# EAGLE schematic maplepad_pro (EAGLE 9.6.1)
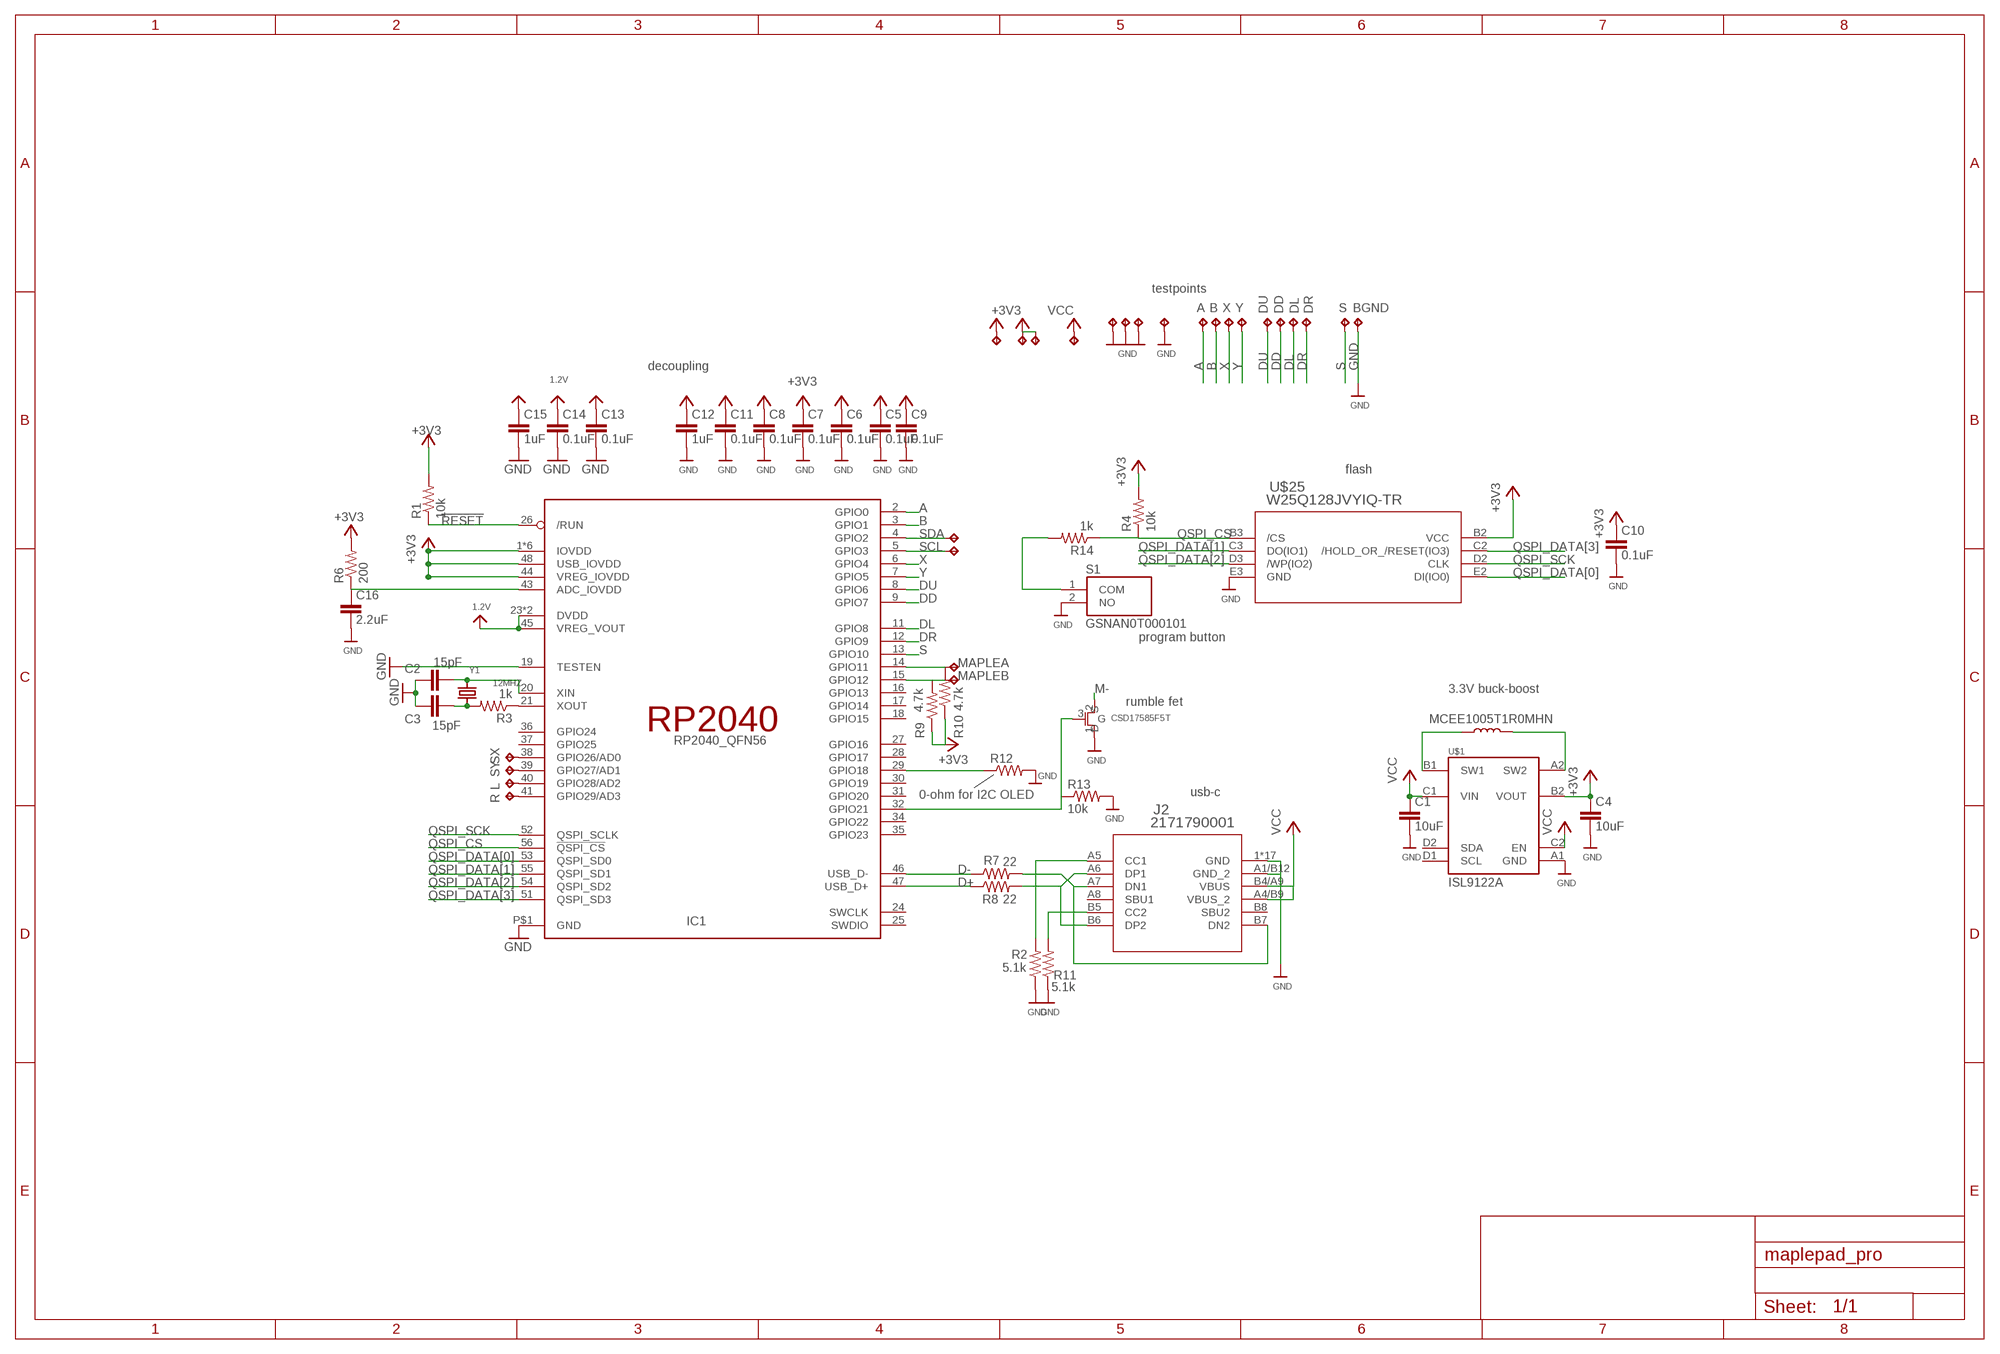
[diagram p0: schematic, sheet 1]

## Parts
A  TPTP10R  [TP10R]
A0  TPTP10R  [TP10R]
B  TPTP10R  [TP10R]
B0  TPTP10R  [TP10R]
BGND  TPTP10R  [TP10R]
C1  10uF  C-USC0402  [C0402]
C2  15pF  C-USC0201  [C0201]
C3  15pF  C-USC0201  [C0201]
C4  10uF  C-USC0402  [C0402]
C5  0.1uF  C-USC0201  [C0201]
C6  0.1uF  C-USC0201  [C0201]
C7  0.1uF  C-USC0201  [C0201]
C8  0.1uF  C-USC0201  [C0201]
C9  0.1uF  C-USC0201  [C0201]
C10  0.1uF  C-USC0201  [C0201]
C11  0.1uF  C-USC0201  [C0201]
C12  1uF  C-USC0402  [C0402]
C13  0.1uF  C-USC0201  [C0201]
C14  0.1uF  C-USC0201  [C0201]
C15  1uF  C-USC0402  [C0402]
C16  2.2uF  C-USC0402  [C0402]
DD  TPTP10R  [TP10R]
DL  TPTP10R  [TP10R]
DR  TPTP10R  [TP10R]
DU  TPTP10R  [TP10R]
IC1  RP2040_QFN56  [QFN56_7MM_REDUCEDEPAD]
J2  2171790001  [2171790001_MOL]
L  TPTP10R  [TP10R]
L2  MCEE1005T1R0MHN  L0402  [R0402]
LR3.1  TPTP10R  [TP10R]
LR3.3  TPTP10R  [TP10R]
LRGND  TPTP10R  [TP10R]
LRGND1  TPTP10R  [TP10R]
R  TPTP10R  [TP10R]
R1  10k  R-US_R0201  [R0201]
R2  5.1k  R-US_R0201  [R0201]
R3  1k  R-US_R0201  [R0201]
R4  10k  R-US_R0201  [R0201]
R6  200  R-US_R0201  [R0201]
R7  22  R-US_R0201  [R0201]
R8  22  R-US_R0201  [R0201]
R9  4.7k  R-US_R0201  [R0201]
R10  4.7k  R-US_R0201  [R0201]
R11  5.1k  R-US_R0201  [R0201]
R12  0-ohm for I2C OLED  R-US_R0201  [R0201]
R13  10k  R-US_R0201  [R0201]
R14  1k  R-US_R0201  [R0201]
S  TPTP10R  [TP10R]
S1  GSNAN0T000101  [GSNAN0T000101]
S3.3  TPTP10R  [TP10R]
SCL  TPTP10R  [TP10R]
SDA  TPTP10R  [TP10R]
SGND  TPTP10R  [TP10R]
SX  TPTP10R  [TP10R]
SY  TPTP10R  [TP10R]
U1  CSD17585F5T  [YJK3_TEX]
U$1  ISL9122A  [ISL9122A]
U$25  W25Q128JVYIQ-TR  [WLCSP24]
V3.3  TPTP10R  [TP10R]
VGND  TPTP10R  [TP10R]
X  TPTP10R  [TP10R]
Y  TPTP10R  [TP10R]
Y1  12MHZ  CRYSTAL2.5X2.0  [CRYSTAL_2.5X2]

## Nets
1.2V: C13.1 C14.1 C15.1 IC1.23(DVDD) IC1.45(VREG_VOUT) IC1.50(DVDD)
!RESET: IC1.26(/RUN) R1.1
+3V3: C4.1 C5.1 C6.1 C7.1 C8.1 C9.1 C10.1 C11.1 C12.1 IC1.1(IOVDD) IC1.10(IOVDD) IC1.22(IOVDD) IC1.33(IOVDD) IC1.42(IOVDD) IC1.44(VREG_IOVDD) IC1.48(USB_IOVDD) IC1.49(IOVDD) LR3.3.TP R1.2 R4.2 R6.2 R9.1 R10.1 S3.3.TP U$1.B2(VOUT) U$25.B2(VCC) V3.3.TP
A: A.TP IC1.2(GPIO0)
B: B.TP IC1.3(GPIO1)
D+: IC1.47(USB_D+) R8.1
D-: IC1.46(USB_D-) R7.1
DD: DD.TP IC1.9(GPIO7)
DL: DL.TP IC1.11(GPIO8)
DR: DR.TP IC1.12(GPIO9)
DU: DU.TP IC1.8(GPIO6)
GND [power]: BGND.TP C1.2 C2.1 C3.1 C4.2 C5.2 C6.2 C7.2 C8.2 C9.2 C10.2 C11.2 C12.2 C13.2 C14.2 C15.2 C16.2 IC1.19(TESTEN) IC1.P$1(GND) J2.1(GND) J2.2(GND) J2.3(GND) J2.4(GND) J2.13(GND) J2.14(GND) J2.15(GND) J2.16(GND) J2.A1/B12(GND_2) J2.B1/A12(GND) J2.S_1_H1(GND) J2.S_1_H2(GND) J2.S_2_H1(GND) J2.S_2_H2(GND) J2.S_3_H1(GND) J2.S_3_H2(GND) J2.S_4_H1(GND) J2.S_4_H2(GND) LRGND1.TP LRGND.TP R2.1 R11.1 R12.2 R13.2 S1.2(NO) SGND.TP U1.1(S) U$1.A1(GND) U$25.E3(GND) VGND.TP
M-: U1.2(D)
MAPLEA: A0.TP IC1.14(GPIO11) R10.2
MAPLEB: B0.TP IC1.15(GPIO12) R9.2
N$1: IC1.41(GPIO29/AD3) R.TP
N$2: IC1.40(GPIO28/AD2) L.TP
N$3: L2.1 U$1.B1(SW1)
N$4: L2.2 U$1.A2(SW2)
N$5: C2.2 IC1.20(XIN) Y1.3
N$6: C3.2 R3.2 Y1.1
N$7: IC1.21(XOUT) R3.1
N$8: R14.2 S1.1(COM)
N$9: C16.1 IC1.43(ADC_IOVDD) R6.1
N$10: J2.A7(DN1) J2.B7(DN2) R7.2
N$11: J2.A6(DP1) J2.B6(DP2) R8.2
N$12: IC1.39(GPIO27/AD1) SY.TP
N$13: IC1.38(GPIO26/AD0) SX.TP
N$16: IC1.29(GPIO18) R12.1
N$17: J2.B5(CC2) R11.2
N$18: J2.A5(CC1) R2.2
N$20: IC1.32(GPIO21) R13.1 U1.3(G)
QSPI_CS: IC1.56(!QSPI_CS) R4.1 R14.1 U$25.B3(/CS)
QSPI_DATA[0]: IC1.53(QSPI_SD0) U$25.E2(DI(IO0))
QSPI_DATA[1]: IC1.55(QSPI_SD1) U$25.C3(DO(IO1))
QSPI_DATA[2]: IC1.54(QSPI_SD2) U$25.D3(/WP(IO2))
QSPI_DATA[3]: IC1.51(QSPI_SD3) U$25.C2(/HOLD_OR_/RESET(IO3))
QSPI_SCK: IC1.52(QSPI_SCLK) U$25.D2(CLK)
S: IC1.13(GPIO10) S.TP
SCL: IC1.5(GPIO3) SCL.TP
SDA: IC1.4(GPIO2) SDA.TP
VCC: C1.1 J2.A4/B9(VBUS_2) J2.B4/A9(VBUS) LR3.1.TP U$1.C1(VIN) U$1.C2(EN)
X: IC1.6(GPIO4) X.TP
Y: IC1.7(GPIO5) Y.TP
Unconnected: IC1.16(GPIO13) IC1.17(GPIO14) IC1.18(GPIO15) IC1.24(SWCLK) IC1.25(SWDIO) IC1.27(GPIO16) IC1.28(GPIO17) IC1.30(GPIO19) IC1.31(GPIO20) IC1.34(GPIO22) IC1.35(GPIO23) IC1.36(GPIO24) IC1.37(GPIO25) J2.A8(SBU1) J2.B8(SBU2) U$1.D1(SCL) U$1.D2(SDA)

## Notes on the sheet
- testpoints
- decoupling
- flash
- program button
- 3.3V buck-boost
- rumble fet
- MCEE1005T1R0MHN
- usb-c
- ISL9122A

## Library data of the parts
A A0 B B0 BGND DD DL DR DU L LR3.1 LR3.3 LRGND LRGND1 R S S3.3 SCL SDA SGND SX SY V3.3 VGND X Y = testpad:TP: Test pad
C1-C16 = resistor:C-US: CAPACITOR, American symbol
IC1 = personal:RP2040
J2 = personal:2171790001; COPYRIGHT: Copyright (C) 2022 Ultra Librarian. All rights reserved.; MANUFACTURER_PART_NUMBER: 2171790001; MFR_NAME: Molex Connector Corporation
L2 = resistor:L0402
R1-R4 R6-R14 = resistor:R-US_: RESISTOR, American symbol
S1 = personal:GSNAN0T000101: Tactile Switches NANOT 100 AS Source: Datasheet <https://www.ckswitches.com/media/2866/nanot.pdf>; DESCRIPTION: Tactile Switches NANOT 100 AS; HEIGHT: 0.55mm; MANUFACTURER_NAME: C & K COMPONENTS; MANUFACTURER_PART_NUMBER: GSNAN0T000101; MOUSER_PART_NUMBER: 611-GSNAN0T000101; MOUSER_PRICE-STOCK: https://www.mouser.co.uk/ProductDetail/CK/GSNAN0T000101?qs=bAKSY%2FctAC7diJ%2FxJL3YRQ%3D%3D
U1 = personal:CSD17585F5T; COPYRIGHT: Copyright (C) 2018 Accelerated Designs. All rights reserved; MANUFACTURER_PART_NUMBER: CSD17585F5T; SOURCELIBRARY: TI_2019-05-21; VENDOR: Texas Instruments
U$1 = personal:ISL9122A
U$25 = personal:W25Q128JVYIQ-TR
Y1 = personal:CRYSTAL: Crystals HC49UP - Surface Mount Crystal 4.0MHz 18pF +/-30ppm Surface Mount Crystal [Digikey: 535-9857-1-ND] 12.0 MHz Surface Mount Crystal [Digikey: 535-9869-6-ND] 25.0 MHz Surface Mount Crystal [Digikey: 535-9078-1-ND] 2.5 x 2.0mm - MEMs SMT Crystal 16.0 MHz 10pF 20ppm 2.5 x 2.0mm Crystal [Digikey -40-85°C: 535-10923-1-ND] 3.2 x 2.5mm - MEMs SMT Crystal 12.0 MHz 8pF 15ppm 3.2 x 2.5mm Crystal [Digikey: -10-70°C: 644-1047-1-ND -40-125°C: 644-1128-1-ND] 40~85°C cheaper: 644-1173-6-ND 16.0 MHz 8pF 15ppm 3.2 x 2.5mm Crystal [Digikey: -10-70°C: 644-1049-1-ND -40-125°C: 644-1129-2-ND]-40~85°C cheaper: 644-1175-6-ND 16.0 MHz 10pF 10ppm 3.2 x 2.5mm Crystal [Digikey: 644-1100-1-ND] 27.12 MHz 18pF 30ppm 3.2 x 2.5mm Crystal [Digikey: 887-1424-1-ND] 27.12MHz 10pF 10ppm 3.2 x 2.5mm Crystal [Digikey: 887-1329-1-ND] 4.9 x 1.8mm - MEMs SMT Crystal 32.768 KHz 12.5pF 20ppm 4.9 x 1.8mm Crystal [Digikey: SE2415CT-ND] 8.0 x 3.8mm - Surface Mount Crystal 32.768kHz 12.5pF 20ppm -40°C-85°C [Digikey: 535-9166-2-ND] Cylinder 32.768KHz Cylinder Crystal (2x6mm body) [Ex. Digikey: 300-8341-2-ND]

## Net classes
1 power: width 0.305 mm